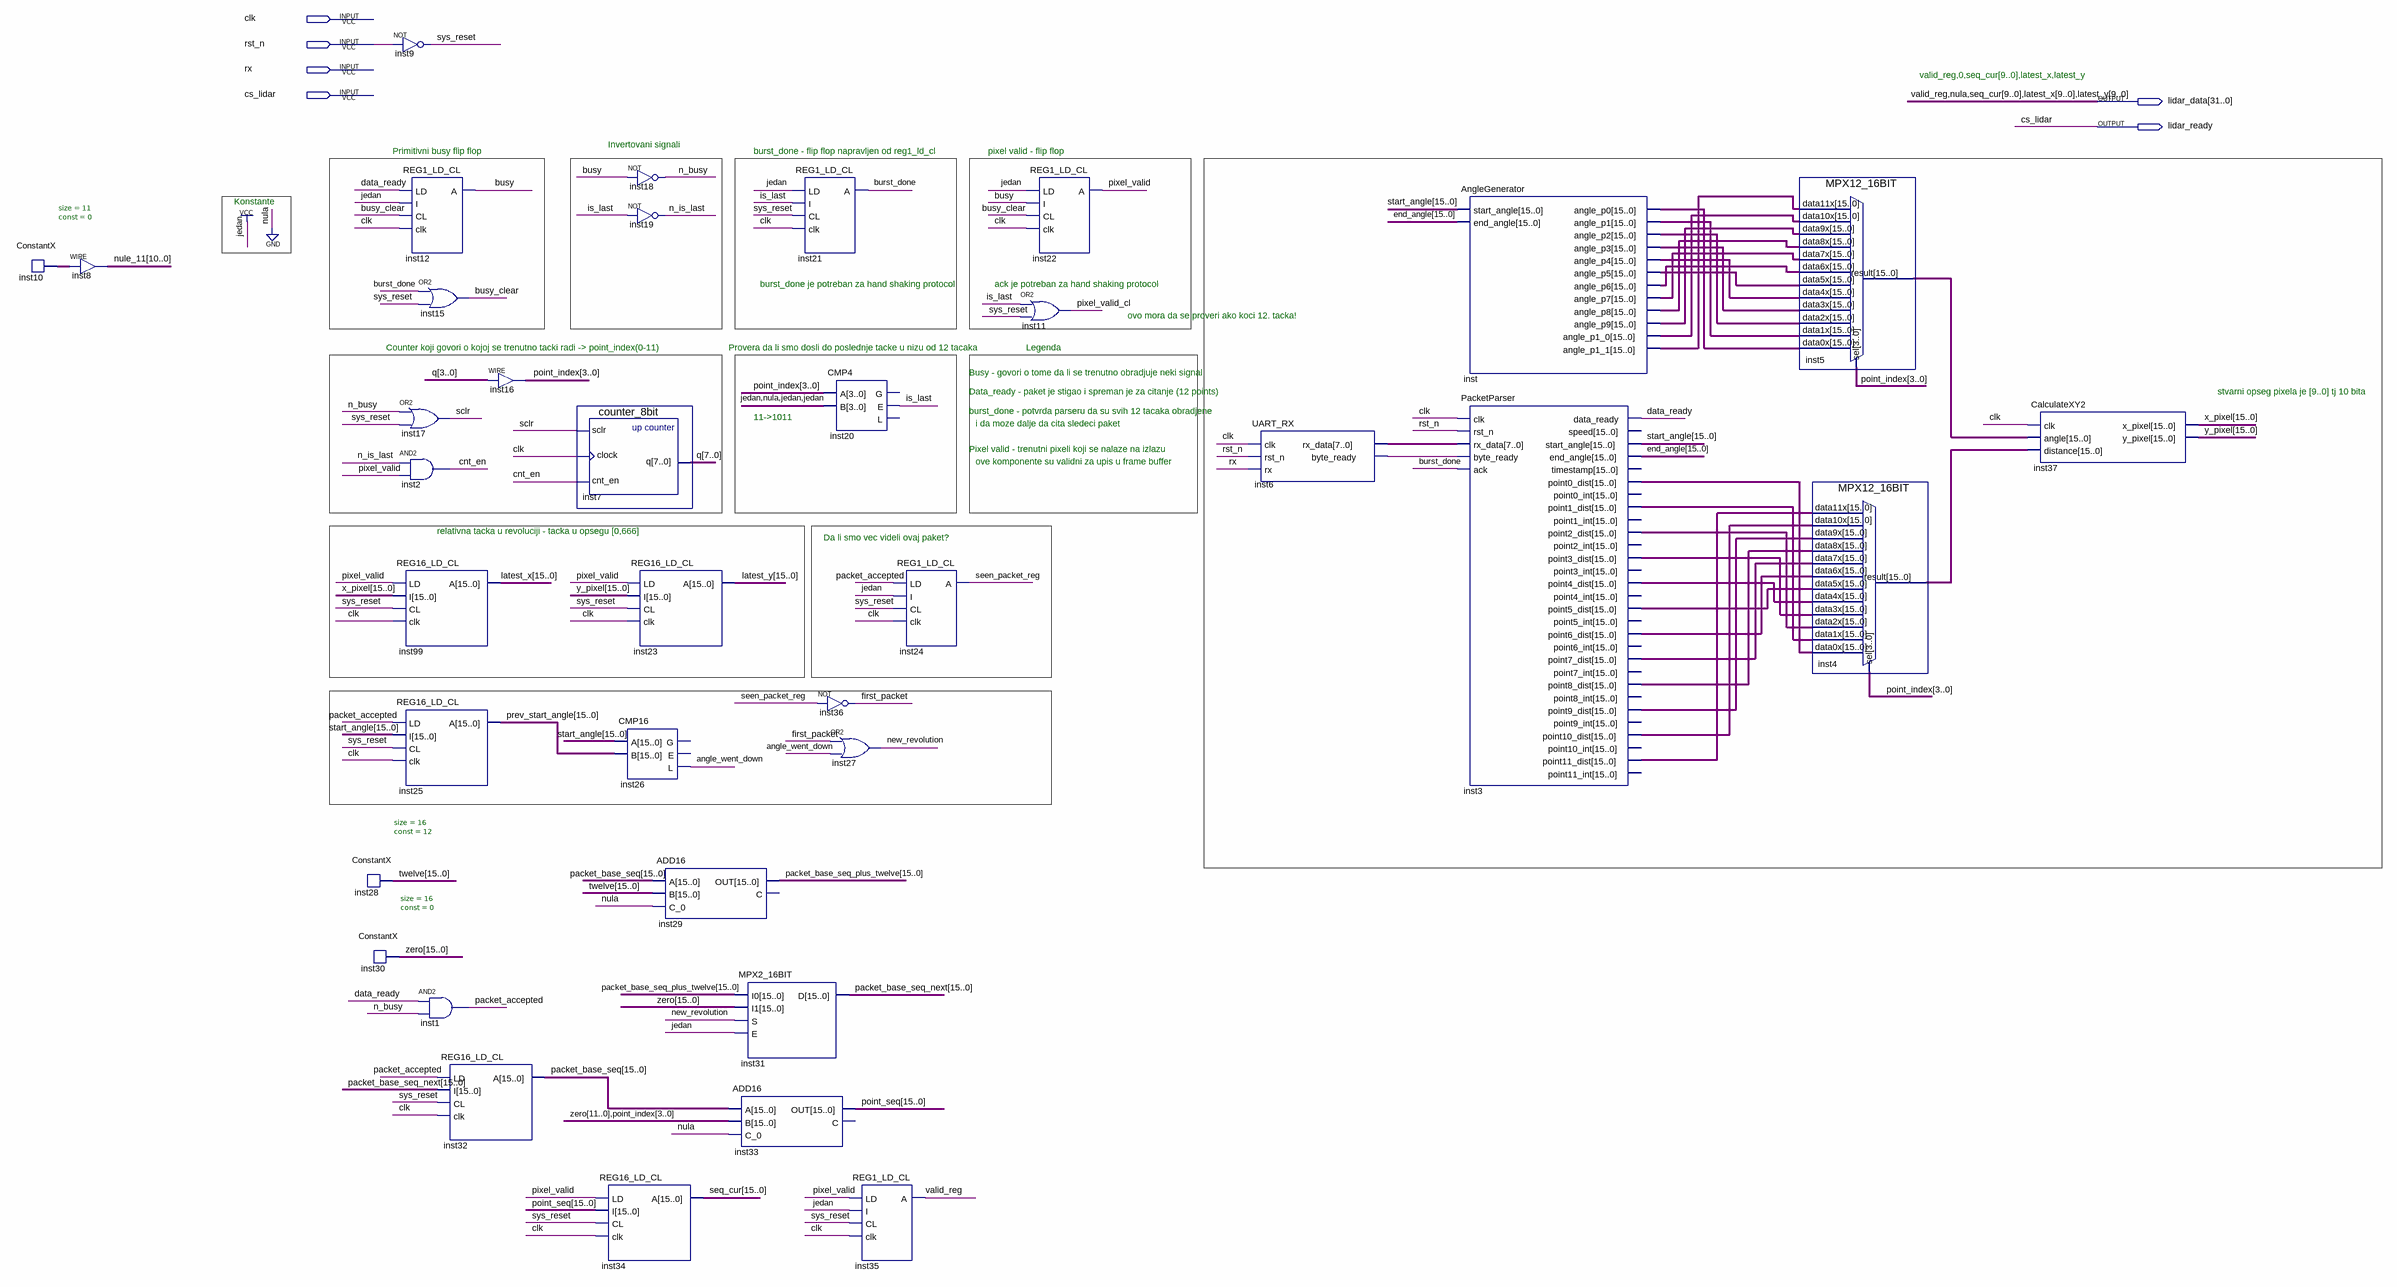
[diagram p0: schematic sheet]
// Quartus schematic LidarInterface2.bdf as structural Verilog: 37 symbols, 6 pins
module LidarInterface2 (
  input  clk,
  input  rst_n,
  input  rx,
  input  cs_lidar,
  output [31:0] lidar_data,
  output lidar_ready
);

  wire angle_went_down, burst_done, busy, busy_clear, cnt_en, data_ready, first_packet, inst6_byte_ready,
       is_last, n_busy, n_is_last, new_revolution, packet_accepted, pixel_valid, pixel_valid_cl, sclr,
       seen_packet_reg, sys_reset;
  wire [3:0] point_index;
  wire [7:0] inst6_rx_data, q;
  wire [10:0] inst10_data_out, nule_11;
  wire [15:0] end_angle, inst3_point0_dist, inst3_point1_dist, inst3_point2_dist, inst3_point3_dist,
       inst3_point4_dist, inst3_point5_dist, inst3_point6_dist, inst3_point7_dist, inst3_point8_dist,
       inst3_point9_dist, inst3_point10_dist, inst3_point11_dist, inst4_result, inst5_result, inst_angle_p0,
       inst_angle_p1, inst_angle_p1_0, inst_angle_p1_1, inst_angle_p2, inst_angle_p3, inst_angle_p4,
       inst_angle_p5, inst_angle_p6, inst_angle_p7, inst_angle_p8, inst_angle_p9, packet_base_seq,
       packet_base_seq_next, packet_base_seq_plus_twelve, point_seq, prev_start_angle, start_angle, twelve,
       x_pixel, y_pixel, zero;
  wire [15:10] latest_x, latest_y, seq_cur;

  ConstantX #(.size(11), .\const (0)) inst10 (.DATA_OUT(inst10_data_out));
  assign nule_11 = inst10_data_out;  // WIRE inst8
  ConstantX #(.size(16), .\const (12)) inst28 (.DATA_OUT(twelve));
  not inst9 (sys_reset, rst_n);
  REG1_LD_CL inst12 (.LD(data_ready), .I(1'b1), .CL(busy_clear), .clk(clk), .A(busy));
  or inst17 (sclr, n_busy, sys_reset);
  and inst2 (cnt_en, n_is_last, pixel_valid);
  REG16_LD_CL inst99 (.LD(pixel_valid), .I(x_pixel), .CL(sys_reset), .clk(clk), .A({latest_x, lidar_data[19:10]}));
  REG16_LD_CL inst25 (.LD(packet_accepted), .I(start_angle), .CL(sys_reset), .clk(clk), .A(prev_start_angle));
  ConstantX #(.size(16), .\const (0)) inst30 (.DATA_OUT(zero));
  or inst15 (busy_clear, burst_done, sys_reset);
  and inst1 (packet_accepted, data_ready, n_busy);
  REG16_LD_CL inst32 (.LD(packet_accepted), .I(packet_base_seq_next), .CL(sys_reset), .clk(clk), .A(packet_base_seq));
  assign point_index = q[3:0];  // WIRE inst16
  counter_8bit inst7 (.sclr(sclr), .clock(clk), .cnt_en(cnt_en), .q(q));
  REG16_LD_CL inst34 (.LD(pixel_valid), .I(point_seq), .CL(sys_reset), .clk(clk), .A({seq_cur, lidar_data[29:20]}));
  not inst18 (n_busy, busy);
  not inst19 (n_is_last, is_last);
  REG16_LD_CL inst23 (.LD(pixel_valid), .I(y_pixel), .CL(sys_reset), .clk(clk), .A({latest_y, lidar_data[9:0]}));
  CMP16 inst26 (.A(start_angle), .B(prev_start_angle), .L(angle_went_down));  // open: G, E
  ADD16 inst29 (.A(packet_base_seq), .B(twelve), .C_0(1'b0), .OUT(packet_base_seq_plus_twelve));  // open: C
  MPX2_16BIT inst31 (
    .I0(packet_base_seq_plus_twelve), .I1(zero), .S(new_revolution), .E(1'b1), .D(packet_base_seq_next));
  ADD16 inst33 (.A(packet_base_seq), .B({zero[11:0], point_index}), .C_0(1'b0), .OUT(point_seq));  // open: C
  REG1_LD_CL inst21 (.LD(1'b1), .I(is_last), .CL(sys_reset), .clk(clk), .A(burst_done));
  CMP4 inst20 (.A(point_index), .B(4'b1011), .E(is_last));  // open: G, L
  not inst36 (first_packet, seen_packet_reg);
  or inst27 (new_revolution, first_packet, angle_went_down);
  REG1_LD_CL inst35 (.LD(pixel_valid), .I(1'b1), .CL(sys_reset), .clk(clk), .A(lidar_data[31]));
  REG1_LD_CL inst24 (.LD(packet_accepted), .I(1'b1), .CL(sys_reset), .clk(clk), .A(seen_packet_reg));
  REG1_LD_CL inst22 (.LD(1'b1), .I(busy), .CL(busy_clear), .clk(clk), .A(pixel_valid));
  or inst11 (pixel_valid_cl, is_last, sys_reset);
  UART_RX inst6 (.clk(clk), .rst_n(rst_n), .rx(rx), .rx_data(inst6_rx_data), .byte_ready(inst6_byte_ready));
  AngleGenerator inst (
    .start_angle(start_angle), .end_angle(end_angle), .angle_p0(inst_angle_p0), .angle_p1(inst_angle_p1),
    .angle_p2(inst_angle_p2), .angle_p3(inst_angle_p3), .angle_p4(inst_angle_p4), .angle_p5(inst_angle_p5),
    .angle_p6(inst_angle_p6), .angle_p7(inst_angle_p7), .angle_p8(inst_angle_p8), .angle_p9(inst_angle_p9),
    .angle_p1_0(inst_angle_p1_0), .angle_p1_1(inst_angle_p1_1));
  PacketParser inst3 (
    .clk(clk), .rst_n(rst_n), .rx_data(inst6_rx_data), .byte_ready(inst6_byte_ready), .ack(burst_done),
    .data_ready(data_ready), .start_angle(start_angle), .end_angle(end_angle),
    .point0_dist(inst3_point0_dist), .point1_dist(inst3_point1_dist), .point2_dist(inst3_point2_dist),
    .point3_dist(inst3_point3_dist), .point4_dist(inst3_point4_dist), .point5_dist(inst3_point5_dist),
    .point6_dist(inst3_point6_dist), .point7_dist(inst3_point7_dist), .point8_dist(inst3_point8_dist),
    .point9_dist(inst3_point9_dist), .point10_dist(inst3_point10_dist), .point11_dist(inst3_point11_dist));  // open: speed, timestamp, point0_int, point1_int, point2_int, point3_int, point4_int, point5_int, point6_int, point7_int, point8_int, point9_int, point10_int, point11_int
  MPX12_16BIT inst5 (
    .data11x(inst_angle_p1_1), .data10x(inst_angle_p1_0), .data9x(inst_angle_p9), .data8x(inst_angle_p8),
    .data7x(inst_angle_p7), .data6x(inst_angle_p6), .data5x(inst_angle_p5), .data4x(inst_angle_p4),
    .data3x(inst_angle_p3), .data2x(inst_angle_p2), .data1x(inst_angle_p1), .data0x(inst_angle_p0),
    .sel(point_index), .result(inst5_result));
  MPX12_16BIT inst4 (
    .data11x(inst3_point11_dist), .data10x(inst3_point10_dist), .data9x(inst3_point9_dist),
    .data8x(inst3_point8_dist), .data7x(inst3_point7_dist), .data6x(inst3_point6_dist),
    .data5x(inst3_point5_dist), .data4x(inst3_point4_dist), .data3x(inst3_point3_dist),
    .data2x(inst3_point2_dist), .data1x(inst3_point1_dist), .data0x(inst3_point0_dist), .sel(point_index),
    .result(inst4_result));
  CalculateXY2 inst37 (.clk(clk), .angle(inst5_result), .distance(inst4_result), .x_pixel(x_pixel), .y_pixel(y_pixel));

  assign lidar_data[30] = 1'b0;
  assign lidar_ready = cs_lidar;

  // Other names for the same wires on the sheet: latest_x[9:0] = lidar_data[19:10]; latest_y[9:0] = lidar_data[9:0];
  //   seq_cur[9:0] = lidar_data[29:20]; valid_reg = lidar_data[31]

  // Notes on the sheet:
  //   valid_reg,0,seq_cur[9..0],latest_x,latest_y
  //   Invertovani signali
  //   Primitivni busy flip flop
  //   burst_done - flip flop napravljen od reg1_ld_cl
  //   pixel valid - flip flop
  //   Konstante
  //   burst_done je potreban za hand shaking protocol
  //   ack je potreban za hand shaking protocol
  //   ovo mora da se proveri ako koci 12. tacka!
  //   Counter koji govori o kojoj se trenutno tacki radi -> point_index(0-11)
  //   Provera da li smo dosli do poslednje tacke u nizu od 12 tacaka
  //   Legenda
  //   Busy - govori o tome da li se trenutno obradjuje neki signal
  //   Data_ready - paket je stigao i spreman je za citanje (12 points)
  //   stvarni opseg pixela je [9..0] tj 10 bita
  //   burst_done - potvrda parseru da su svih 12 tacaka obradjene 
  //   11->1011
  //   i da moze dalje da cita sledeci paket
  //   Pixel valid - trenutni pixeli koji se nalaze na izlazu 
  //   ove komponente su validni za upis u frame buffer
  //   relativna tacka u revoluciji - tacka u opsegu [0,666]
  //   Da li smo vec videli ovaj paket?
endmodule
